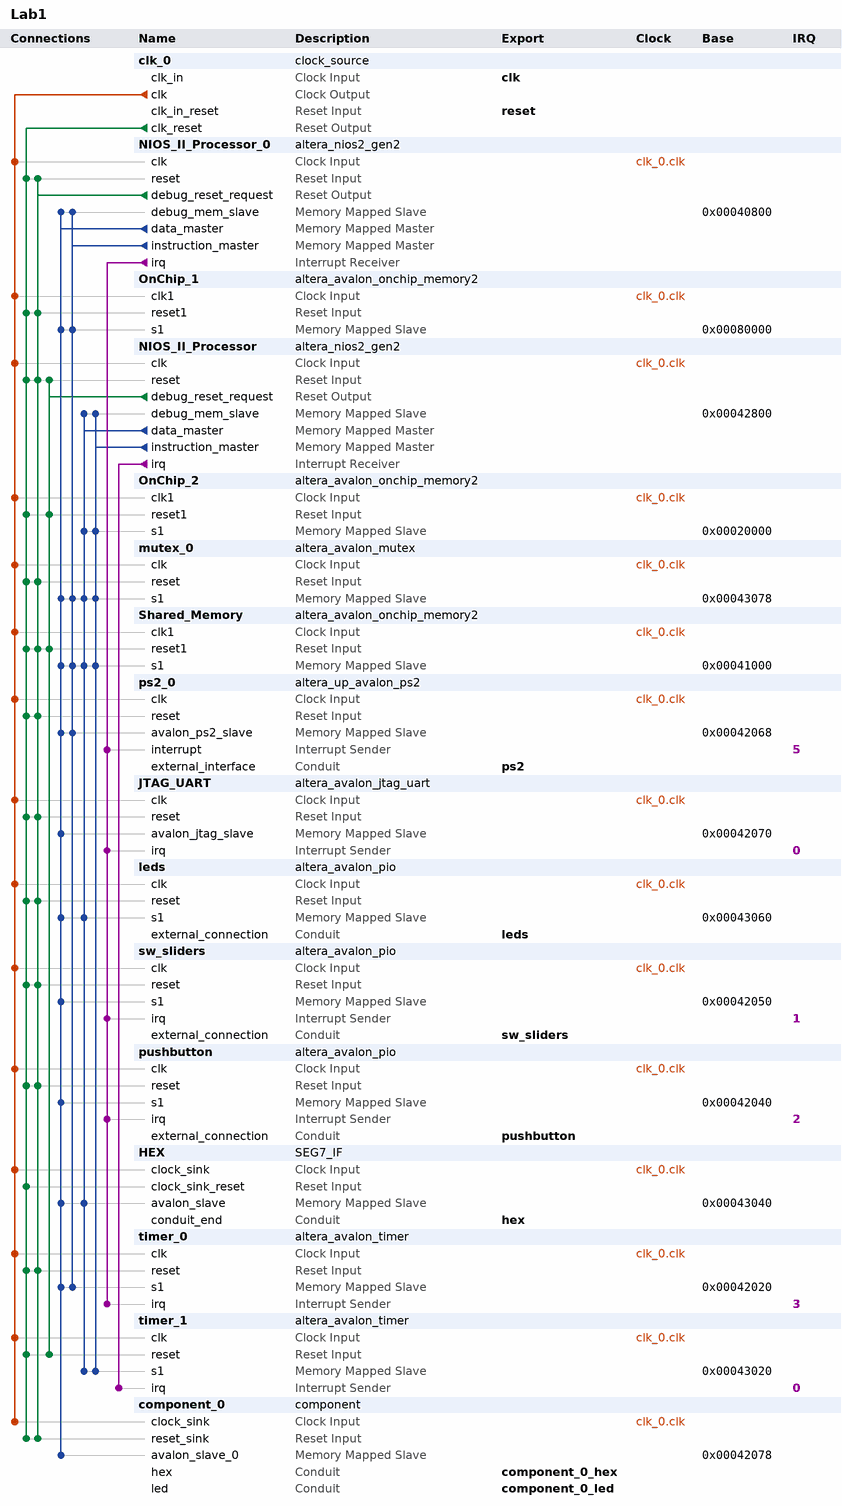
[diagram p0: system contents]
# Platform Designer (Qsys) system Lab1, Cyclone V 5CSEMA5F31C6
# Parameters at their usual value, and those the tool derives, are not listed.
package require -exact qsys 17.1
create_system Lab1
set_project_property DEVICE_FAMILY {Cyclone V}
set_project_property DEVICE 5CSEMA5F31C6

add_instance clk_0 clock_source 17.1
set_instance_parameter_value clk_0 clockFrequency 50000000

add_instance NIOS_II_Processor_0 altera_nios2_gen2 17.1
set_instance_parameter_value NIOS_II_Processor_0 dcache_size 2048
set_instance_parameter_value NIOS_II_Processor_0 exceptionSlave OnChip_1.s1
set_instance_parameter_value NIOS_II_Processor_0 icache_size 4096
set_instance_parameter_value NIOS_II_Processor_0 impl Tiny
set_instance_parameter_value NIOS_II_Processor_0 resetSlave OnChip_1.s1

add_instance OnChip_1 altera_avalon_onchip_memory2 17.1
set_instance_parameter_value OnChip_1 dataWidth 32
set_instance_parameter_value OnChip_1 dualPort false
set_instance_parameter_value OnChip_1 initMemContent true
set_instance_parameter_value OnChip_1 initializationFileName onchip_mem.hex
set_instance_parameter_value OnChip_1 memorySize 200000

add_instance NIOS_II_Processor altera_nios2_gen2 17.1
set_instance_parameter_value NIOS_II_Processor dcache_size 2048
set_instance_parameter_value NIOS_II_Processor exceptionSlave OnChip_2.s1
set_instance_parameter_value NIOS_II_Processor icache_size 4096
set_instance_parameter_value NIOS_II_Processor impl Tiny
set_instance_parameter_value NIOS_II_Processor resetSlave OnChip_2.s1

add_instance OnChip_2 altera_avalon_onchip_memory2 17.1
set_instance_parameter_value OnChip_2 dataWidth 32
set_instance_parameter_value OnChip_2 dualPort false
set_instance_parameter_value OnChip_2 initMemContent true
set_instance_parameter_value OnChip_2 initializationFileName onchip_mem.hex
set_instance_parameter_value OnChip_2 memorySize 100000

add_instance mutex_0 altera_avalon_mutex 17.1

add_instance Shared_Memory altera_avalon_onchip_memory2 17.1
set_instance_parameter_value Shared_Memory dataWidth 32
set_instance_parameter_value Shared_Memory dualPort false
set_instance_parameter_value Shared_Memory initMemContent true
set_instance_parameter_value Shared_Memory initializationFileName onchip_mem.hex
set_instance_parameter_value Shared_Memory memorySize 4096

add_instance ps2_0 altera_up_avalon_ps2 17.1

add_instance JTAG_UART altera_avalon_jtag_uart 17.1
set_instance_parameter_value JTAG_UART simInteractiveOptions NO_INTERACTIVE_WINDOWS

add_instance leds altera_avalon_pio 17.1
set_instance_parameter_value leds direction Output
set_instance_parameter_value leds width 10

add_instance sw_sliders altera_avalon_pio 17.1
set_instance_parameter_value sw_sliders bitClearingEdgeCapReg true
set_instance_parameter_value sw_sliders captureEdge true
set_instance_parameter_value sw_sliders direction Input
set_instance_parameter_value sw_sliders generateIRQ true
set_instance_parameter_value sw_sliders irqType EDGE
set_instance_parameter_value sw_sliders width 10

add_instance pushbutton altera_avalon_pio 17.1
set_instance_parameter_value pushbutton bitClearingEdgeCapReg true
set_instance_parameter_value pushbutton captureEdge true
set_instance_parameter_value pushbutton direction Input
set_instance_parameter_value pushbutton generateIRQ true
set_instance_parameter_value pushbutton irqType EDGE
set_instance_parameter_value pushbutton width 4

add_instance HEX SEG7_IF 1.0
set_instance_parameter_value HEX SEG7_NUM 6

add_instance timer_0 altera_avalon_timer 17.1
set_instance_parameter_value timer_0 period 1
set_instance_parameter_value timer_0 periodUnits MSEC

add_instance timer_1 altera_avalon_timer 17.1
set_instance_parameter_value timer_1 period 1
set_instance_parameter_value timer_1 periodUnits MSEC

add_instance component_0 component 1.0

# connections
add_connection clk_0.clk component_0.clock_sink clock
add_connection clk_0.clk HEX.clock_sink clock
add_connection clk_0.clk JTAG_UART.clk clock
add_connection clk_0.clk leds.clk clock
add_connection clk_0.clk mutex_0.clk clock
add_connection clk_0.clk NIOS_II_Processor.clk clock
add_connection clk_0.clk NIOS_II_Processor_0.clk clock
add_connection clk_0.clk OnChip_1.clk1 clock
add_connection clk_0.clk OnChip_2.clk1 clock
add_connection clk_0.clk ps2_0.clk clock
add_connection clk_0.clk pushbutton.clk clock
add_connection clk_0.clk Shared_Memory.clk1 clock
add_connection clk_0.clk sw_sliders.clk clock
add_connection clk_0.clk timer_0.clk clock
add_connection clk_0.clk timer_1.clk clock
add_connection clk_0.clk_reset component_0.reset_sink reset
add_connection clk_0.clk_reset HEX.clock_sink_reset reset
add_connection clk_0.clk_reset JTAG_UART.reset reset
add_connection clk_0.clk_reset leds.reset reset
add_connection clk_0.clk_reset mutex_0.reset reset
add_connection clk_0.clk_reset NIOS_II_Processor.reset reset
add_connection clk_0.clk_reset NIOS_II_Processor_0.reset reset
add_connection clk_0.clk_reset OnChip_1.reset1 reset
add_connection clk_0.clk_reset OnChip_2.reset1 reset
add_connection clk_0.clk_reset ps2_0.reset reset
add_connection clk_0.clk_reset pushbutton.reset reset
add_connection clk_0.clk_reset Shared_Memory.reset1 reset
add_connection clk_0.clk_reset sw_sliders.reset reset
add_connection clk_0.clk_reset timer_0.reset reset
add_connection clk_0.clk_reset timer_1.reset reset
add_connection NIOS_II_Processor.debug_reset_request NIOS_II_Processor.reset reset
add_connection NIOS_II_Processor.debug_reset_request OnChip_2.reset1 reset
add_connection NIOS_II_Processor.debug_reset_request Shared_Memory.reset1 reset
add_connection NIOS_II_Processor.debug_reset_request timer_1.reset reset
add_connection NIOS_II_Processor_0.debug_reset_request component_0.reset_sink reset
add_connection NIOS_II_Processor_0.debug_reset_request JTAG_UART.reset reset
add_connection NIOS_II_Processor_0.debug_reset_request leds.reset reset
add_connection NIOS_II_Processor_0.debug_reset_request mutex_0.reset reset
add_connection NIOS_II_Processor_0.debug_reset_request NIOS_II_Processor.reset reset
add_connection NIOS_II_Processor_0.debug_reset_request NIOS_II_Processor_0.reset reset
add_connection NIOS_II_Processor_0.debug_reset_request OnChip_1.reset1 reset
add_connection NIOS_II_Processor_0.debug_reset_request ps2_0.reset reset
add_connection NIOS_II_Processor_0.debug_reset_request pushbutton.reset reset
add_connection NIOS_II_Processor_0.debug_reset_request Shared_Memory.reset1 reset
add_connection NIOS_II_Processor_0.debug_reset_request sw_sliders.reset reset
add_connection NIOS_II_Processor_0.debug_reset_request timer_0.reset reset
add_connection NIOS_II_Processor.data_master HEX.avalon_slave avalon
set_connection_parameter_value NIOS_II_Processor.data_master/HEX.avalon_slave baseAddress 0x00043040
add_connection NIOS_II_Processor.data_master leds.s1 avalon
set_connection_parameter_value NIOS_II_Processor.data_master/leds.s1 baseAddress 0x00043060
add_connection NIOS_II_Processor.data_master mutex_0.s1 avalon
set_connection_parameter_value NIOS_II_Processor.data_master/mutex_0.s1 baseAddress 0x00043078
add_connection NIOS_II_Processor.data_master NIOS_II_Processor.debug_mem_slave avalon
set_connection_parameter_value NIOS_II_Processor.data_master/NIOS_II_Processor.debug_mem_slave baseAddress 0x00042800
add_connection NIOS_II_Processor.data_master OnChip_2.s1 avalon
set_connection_parameter_value NIOS_II_Processor.data_master/OnChip_2.s1 baseAddress 0x00020000
add_connection NIOS_II_Processor.data_master Shared_Memory.s1 avalon
set_connection_parameter_value NIOS_II_Processor.data_master/Shared_Memory.s1 baseAddress 0x00041000
add_connection NIOS_II_Processor.data_master timer_1.s1 avalon
set_connection_parameter_value NIOS_II_Processor.data_master/timer_1.s1 baseAddress 0x00043020
add_connection NIOS_II_Processor.instruction_master mutex_0.s1 avalon
set_connection_parameter_value NIOS_II_Processor.instruction_master/mutex_0.s1 baseAddress 0x00043078
add_connection NIOS_II_Processor.instruction_master NIOS_II_Processor.debug_mem_slave avalon
set_connection_parameter_value NIOS_II_Processor.instruction_master/NIOS_II_Processor.debug_mem_slave baseAddress 0x00042800
add_connection NIOS_II_Processor.instruction_master OnChip_2.s1 avalon
set_connection_parameter_value NIOS_II_Processor.instruction_master/OnChip_2.s1 baseAddress 0x00020000
add_connection NIOS_II_Processor.instruction_master Shared_Memory.s1 avalon
set_connection_parameter_value NIOS_II_Processor.instruction_master/Shared_Memory.s1 baseAddress 0x00041000
add_connection NIOS_II_Processor.instruction_master timer_1.s1 avalon
set_connection_parameter_value NIOS_II_Processor.instruction_master/timer_1.s1 baseAddress 0x00043020
add_connection NIOS_II_Processor_0.data_master component_0.avalon_slave_0 avalon
set_connection_parameter_value NIOS_II_Processor_0.data_master/component_0.avalon_slave_0 baseAddress 0x00042078
add_connection NIOS_II_Processor_0.data_master HEX.avalon_slave avalon
set_connection_parameter_value NIOS_II_Processor_0.data_master/HEX.avalon_slave baseAddress 0x00043040
add_connection NIOS_II_Processor_0.data_master JTAG_UART.avalon_jtag_slave avalon
set_connection_parameter_value NIOS_II_Processor_0.data_master/JTAG_UART.avalon_jtag_slave baseAddress 0x00042070
add_connection NIOS_II_Processor_0.data_master leds.s1 avalon
set_connection_parameter_value NIOS_II_Processor_0.data_master/leds.s1 baseAddress 0x00043060
add_connection NIOS_II_Processor_0.data_master mutex_0.s1 avalon
set_connection_parameter_value NIOS_II_Processor_0.data_master/mutex_0.s1 baseAddress 0x00043078
add_connection NIOS_II_Processor_0.data_master NIOS_II_Processor_0.debug_mem_slave avalon
set_connection_parameter_value NIOS_II_Processor_0.data_master/NIOS_II_Processor_0.debug_mem_slave baseAddress 0x00040800
add_connection NIOS_II_Processor_0.data_master OnChip_1.s1 avalon
set_connection_parameter_value NIOS_II_Processor_0.data_master/OnChip_1.s1 baseAddress 0x00080000
add_connection NIOS_II_Processor_0.data_master ps2_0.avalon_ps2_slave avalon
set_connection_parameter_value NIOS_II_Processor_0.data_master/ps2_0.avalon_ps2_slave baseAddress 0x00042068
add_connection NIOS_II_Processor_0.data_master pushbutton.s1 avalon
set_connection_parameter_value NIOS_II_Processor_0.data_master/pushbutton.s1 baseAddress 0x00042040
add_connection NIOS_II_Processor_0.data_master Shared_Memory.s1 avalon
set_connection_parameter_value NIOS_II_Processor_0.data_master/Shared_Memory.s1 baseAddress 0x00041000
add_connection NIOS_II_Processor_0.data_master sw_sliders.s1 avalon
set_connection_parameter_value NIOS_II_Processor_0.data_master/sw_sliders.s1 baseAddress 0x00042050
add_connection NIOS_II_Processor_0.data_master timer_0.s1 avalon
set_connection_parameter_value NIOS_II_Processor_0.data_master/timer_0.s1 baseAddress 0x00042020
add_connection NIOS_II_Processor_0.instruction_master mutex_0.s1 avalon
set_connection_parameter_value NIOS_II_Processor_0.instruction_master/mutex_0.s1 baseAddress 0x00043078
add_connection NIOS_II_Processor_0.instruction_master NIOS_II_Processor_0.debug_mem_slave avalon
set_connection_parameter_value NIOS_II_Processor_0.instruction_master/NIOS_II_Processor_0.debug_mem_slave baseAddress 0x00040800
add_connection NIOS_II_Processor_0.instruction_master OnChip_1.s1 avalon
set_connection_parameter_value NIOS_II_Processor_0.instruction_master/OnChip_1.s1 baseAddress 0x00080000
add_connection NIOS_II_Processor_0.instruction_master ps2_0.avalon_ps2_slave avalon
set_connection_parameter_value NIOS_II_Processor_0.instruction_master/ps2_0.avalon_ps2_slave baseAddress 0x00042068
add_connection NIOS_II_Processor_0.instruction_master Shared_Memory.s1 avalon
set_connection_parameter_value NIOS_II_Processor_0.instruction_master/Shared_Memory.s1 baseAddress 0x00041000
add_connection NIOS_II_Processor_0.instruction_master timer_0.s1 avalon
set_connection_parameter_value NIOS_II_Processor_0.instruction_master/timer_0.s1 baseAddress 0x00042020
add_connection NIOS_II_Processor.irq timer_1.irq interrupt
set_connection_parameter_value NIOS_II_Processor.irq/timer_1.irq irqNumber 0
add_connection NIOS_II_Processor_0.irq JTAG_UART.irq interrupt
set_connection_parameter_value NIOS_II_Processor_0.irq/JTAG_UART.irq irqNumber 0
add_connection NIOS_II_Processor_0.irq ps2_0.interrupt interrupt
set_connection_parameter_value NIOS_II_Processor_0.irq/ps2_0.interrupt irqNumber 5
add_connection NIOS_II_Processor_0.irq pushbutton.irq interrupt
set_connection_parameter_value NIOS_II_Processor_0.irq/pushbutton.irq irqNumber 2
add_connection NIOS_II_Processor_0.irq sw_sliders.irq interrupt
set_connection_parameter_value NIOS_II_Processor_0.irq/sw_sliders.irq irqNumber 1
add_connection NIOS_II_Processor_0.irq timer_0.irq interrupt
set_connection_parameter_value NIOS_II_Processor_0.irq/timer_0.irq irqNumber 3

# exported interfaces
add_interface clk clock sink
set_interface_property clk EXPORT_OF clk_0.clk_in
add_interface component_0_hex conduit end
set_interface_property component_0_hex EXPORT_OF component_0.hex
add_interface component_0_led conduit end
set_interface_property component_0_led EXPORT_OF component_0.led
add_interface hex conduit end
set_interface_property hex EXPORT_OF HEX.conduit_end
add_interface leds conduit end
set_interface_property leds EXPORT_OF leds.external_connection
add_interface ps2 conduit end
set_interface_property ps2 EXPORT_OF ps2_0.external_interface
add_interface pushbutton conduit end
set_interface_property pushbutton EXPORT_OF pushbutton.external_connection
add_interface reset reset sink
set_interface_property reset EXPORT_OF clk_0.clk_in_reset
add_interface sw_sliders conduit end
set_interface_property sw_sliders EXPORT_OF sw_sliders.external_connection

set_interconnect_requirement {$system} qsys_mm.clockCrossingAdapter HANDSHAKE
set_interconnect_requirement {$system} qsys_mm.enableEccProtection FALSE
set_interconnect_requirement {$system} qsys_mm.insertDefaultSlave FALSE
set_interconnect_requirement {$system} qsys_mm.maxAdditionalLatency 1

save_system Lab1.qsys
